# Altium project arm_control_board1.PrjPcb
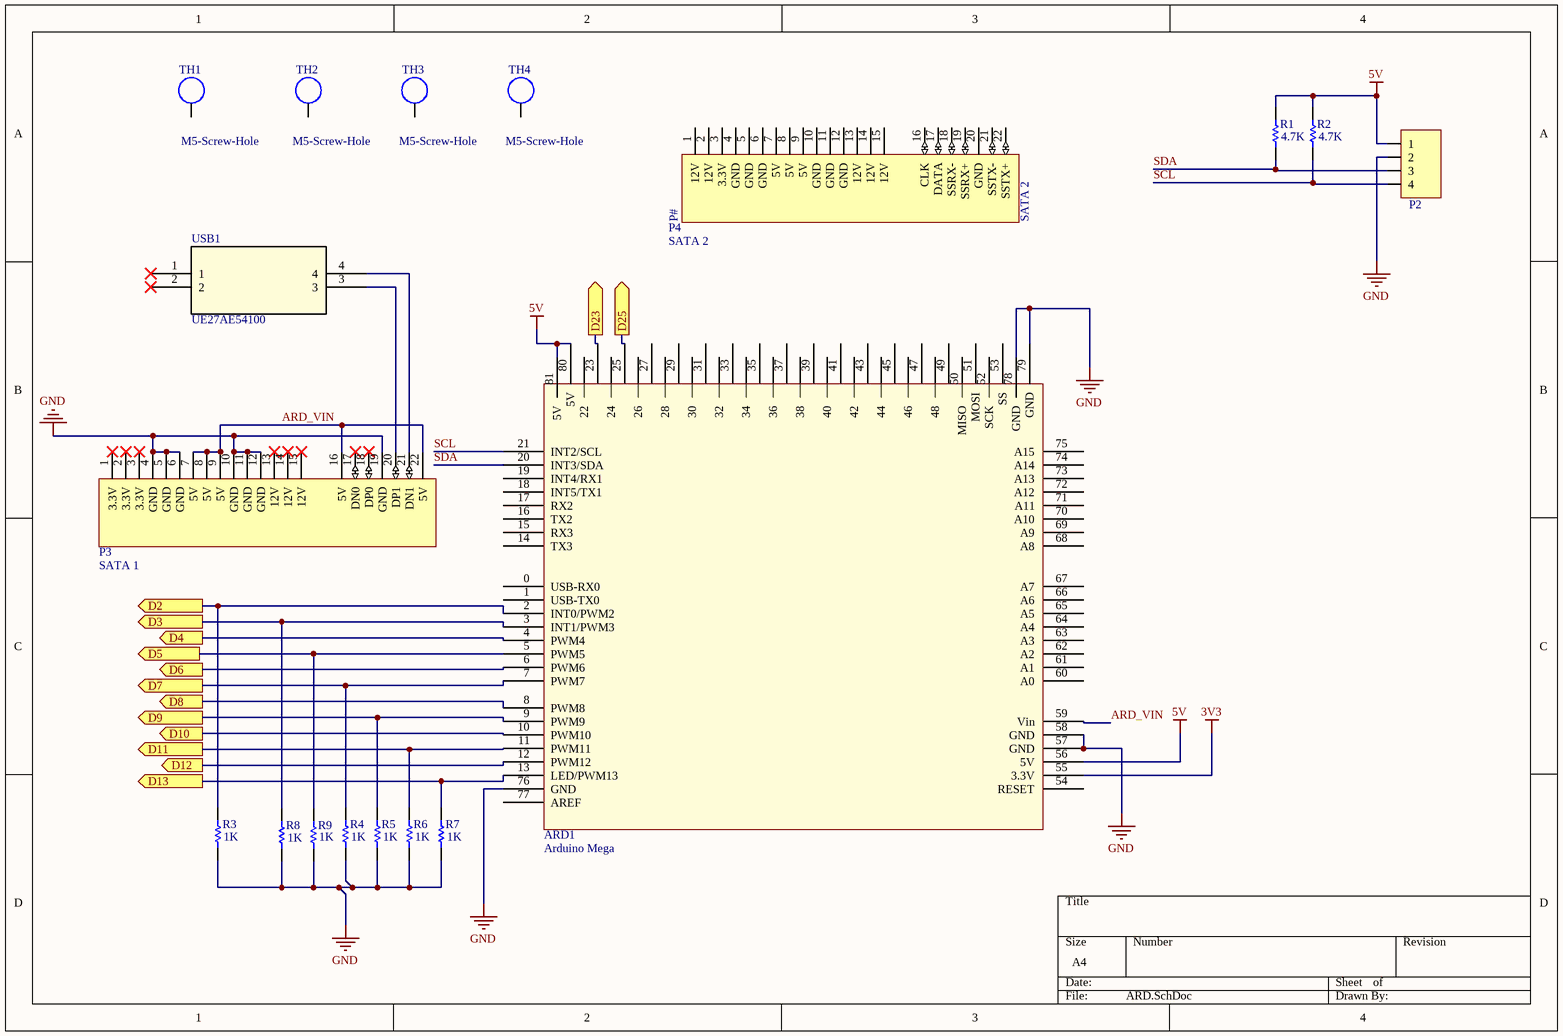
[diagram p0: ARD.SchDoc]
2 sheets, 46 parts. Net scope: flat (ports and power ports of the same name join across sheets).
Board file: Arm_control_pull.PcbDoc
Sheets:
  ARD.SchDoc
  Arm_control_pull.SchDoc

## Sheet ARD.SchDoc
size A4

### Parts
ARD1  Arduino Mega  [Arduino Mega]
P2  Mini-Fit Jr 4 Pos  [MOLEX 0039281043]  (value not drawn)
P3  SATA 1  [Amphenol 10101788-002CLF]
P4  SATA 2  [Amphenol 10101788-002CLF]
R1  value 4.7K  [RESC1608X06N_0603]  (hidden comment: Res1)
R2  value 4.7K  [RESC1608X06N_0603]  (hidden comment: Res1)
R3  value 1K  [RESC1608X06N_0603]  (hidden comment: Res1)
R4  value 1K  [RESC1608X06N_0603]  (hidden comment: Res1)
R5  value 1K  [RESC1608X06N_0603]  (hidden comment: Res1)
R6  value 1K  [RESC1608X06N_0603]  (hidden comment: Res1)
R7  value 1K  [RESC1608X06N_0603]  (hidden comment: Res1)
R8  value 1K  [RESC1608X06N_0603]  (hidden comment: Res1)
R9  value 1K  [RESC1608X06N_0603]  (hidden comment: Res1)
TH1  M5-Screw-Hole  [M5_Screw_Hole]
TH2  M5-Screw-Hole  [M5_Screw_Hole]
TH3  M5-Screw-Hole  [M5_Screw_Hole]
TH4  M5-Screw-Hole  [M5_Screw_Hole]
USB1  UE27AE54100  [UE27AE54100_AMP]

### Ports
D2 (out), D3 (out), D4 (out), D5 (out), D6 (out), D7 (out), D8 (out), D9 (out), D10 (out), D11 (out), D12 (out), D13 (out), D23 (out), D25 (out)

### Nets
3V3: ARD1.55(3.3V)
5V: ARD1.56(5V) ARD1.80(5V) ARD1.81(5V) P2.1 R1.2 R2.2
GND: ARD1.57(GND) ARD1.58(GND) ARD1.76(GND) ARD1.78(GND) ARD1.79(GND) P2.2 P3.4(GND) P3.5(GND) P3.6(GND) P3.10(GND) P3.11(GND) P3.12(GND) P3.19(GND) R3.1 R4.1 R5.1 R6.1 R7.1 R8.1 R9.1
ARD_VIN: ARD1.59(Vin) P3.7(5V) P3.8(5V) P3.9(5V) P3.16(5V) P3.22(5V)
SCL: ARD1.21(INT2/SCL) P2.4 R2.1
SDA: ARD1.20(INT3/SDA) P2.3 R1.1
NetARD1_2: ARD1.2(INT0/PWM2) R3.2 ; port D2
NetARD1_3: ARD1.3(INT1/PWM3) R8.2 ; port D3
NetARD1_4: ARD1.4(PWM4) ; port D4
NetARD1_5: ARD1.5(PWM5) R9.2 ; port D5
NetARD1_6: ARD1.6(PWM6) ; port D6
NetARD1_7: ARD1.7(PWM7) R4.2 ; port D7
NetARD1_8: ARD1.8(PWM8) ; port D8
NetARD1_9: ARD1.9(PWM9) R5.2 ; port D9
NetARD1_10: ARD1.10(PWM10) ; port D10
NetARD1_11: ARD1.11(PWM11) R6.2 ; port D11
NetARD1_12: ARD1.12(PWM12) ; port D12
NetARD1_13: ARD1.13(LED/PWM13) R7.2 ; port D13
NetARD1_23: ARD1.23 ; port D23
NetARD1_25: ARD1.25 ; port D25
NetP3_20: P3.20(DP1) USB1.3
NetP3_21: P3.21(DN1) USB1.4

Not connected (* = marked no-connect by the designer): ARD1 0(USB-RX0) 1(USB-TX0) 14(TX3) 15(RX3) 16(TX2) 17(RX2) 18(INT5/TX1) 19(INT4/RX1) 22 24 26 27 28 29 30 31 32 33 34 35 36 37 38 39 40 41 42 43 44 45 46 47 48 49 50(MISO) 51(MOSI) 52(SCK) 53(SS) 54(RESET) 60(A0) 61(A1) 62(A2) 63(A3) 64(A4) 65(A5) 66(A6) 67(A7) 68(A8) 69(A9) 70(A10) 71(A11) 72(A12) 73(A13) 74(A14) 75(A15) 77(AREF); P3 1(3.3V)* 2(3.3V)* 3(3.3V)* 13(12V)* 14(12V)* 15(12V)* 17(DN0)* 18(DP0)*; P4 1(12V) 2(12V) 3(3.3V) 4(GND) 5(GND) 6(GND) 7(5V) 8(5V) 9(5V) 10(GND) 11(GND) 12(GND) 13(12V) 14(12V) 15(12V) 16(CLK) 17(DATA) 18(SSRX-) 19(SSRX+) 20(GND) 21(SSTX-) 22(SSTX+); TH1 1; TH2 1; TH3 1; TH4 1; USB1 1* 2*

### Notes on the sheet
- (in symbol SATA 2) P#

### Library data of the parts
P2 = Molex 0039281043: Mini-Fit Jr. Header, Dual Row, Right-Angle, with Snap-in Plastic Peg PCB Lock, 6 Circuits, PA Polyamide Nylon 6/6 94V-2, 0.76µm Select Gold (Au) Plating
P3 = SATA 1: SATA connector. / Connector 1 for option 1 as per Spec; Supplier 1: Digi-Key
P4 = SATA 2: SATA connector. / Connector 2 for option 1 as per Spec; Supplier 1: Digi-Key
R1-R9 = Res1: Resistor; Published: 8-Jun-2000; LatestRevisionDate: 17-Jul-2002; LatestRevisionNote: Re-released for DXP Platform.; PackageReference: AXIAL-0.3; Publisher: Altium Limited; PackageDescription: Axial Device, Thru-Hole; 2 Leads; 0.3 in Pin Spacing
USB1 = UE27AE54100: No Description Available; Mfr_Name: Amphenol ICC; Copyright: Copyright (C) 2022 Ultra Librarian. All rights reserved.; Manufacturer_Part_Number: UE27AE54100; Digi-Key_Part_Number_1: UE27AE54100-ND; Digi-Key_Part_Number_2: UE27AE54100-NDL; RefDes: RefDes; Type: DEV

## Sheet Arm_control_pull.SchDoc
size A4
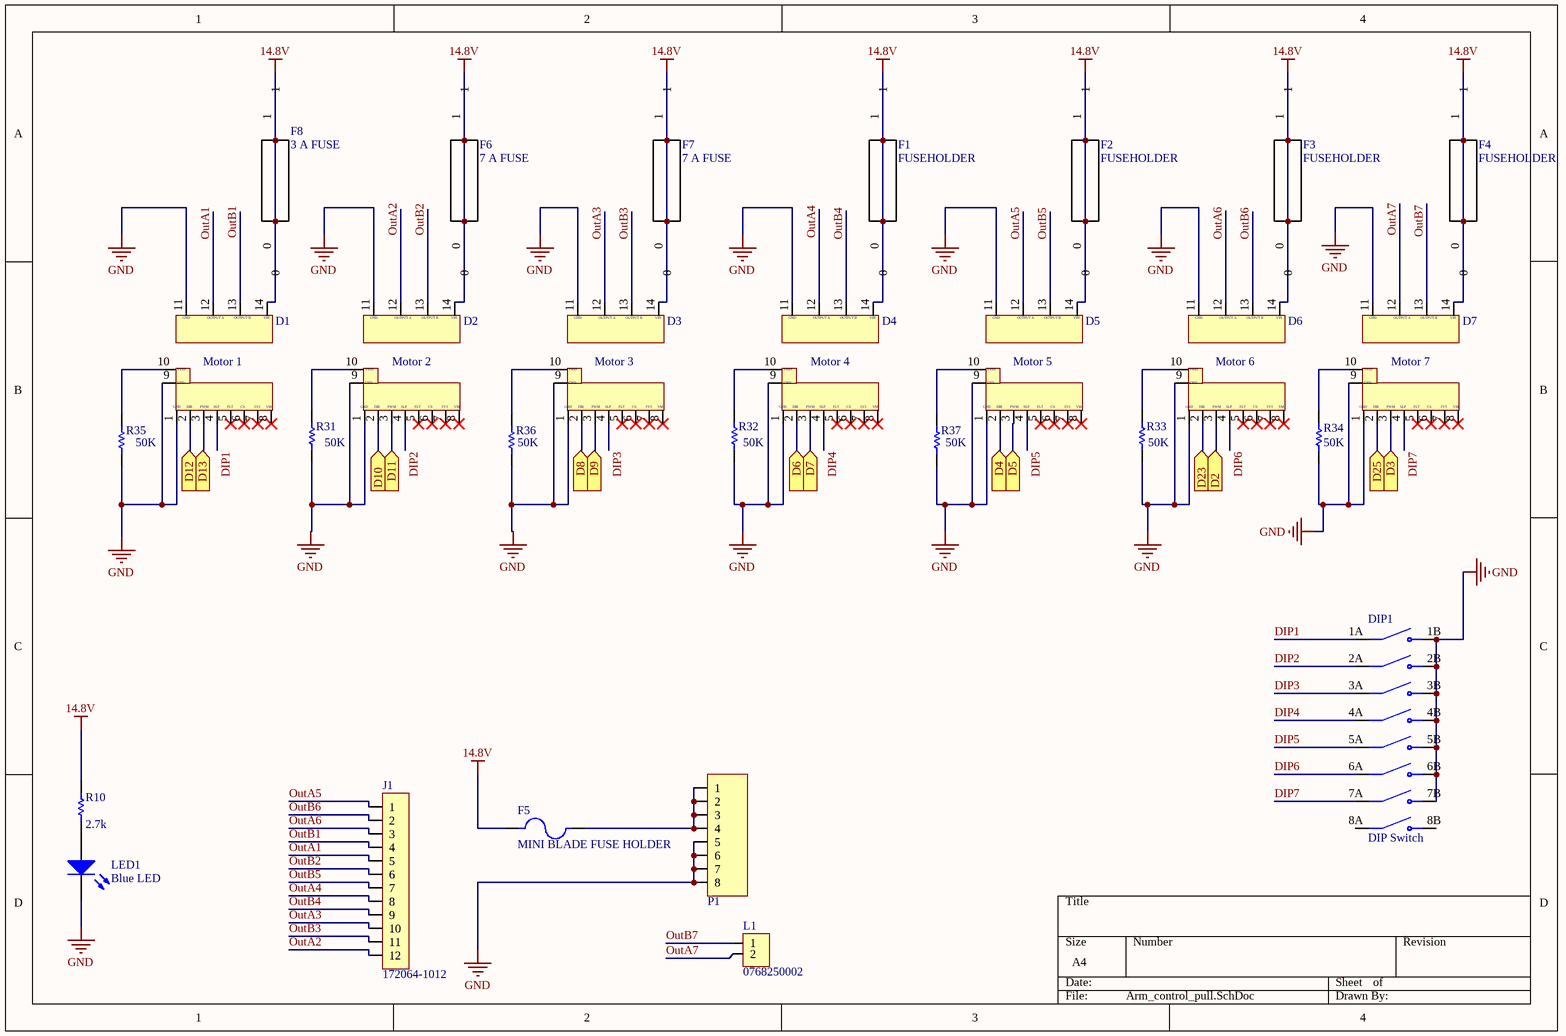
[diagram p1: Arm_control_pull.SchDoc]

### Parts
D1  Pololu G2 High-Power Motor Driver 18v25  [POLOLU 18V25]  (value not drawn)
D2  Pololu G2 High-Power Motor Driver 18v25  [POLOLU 18V25]  (value not drawn)
D3  Pololu G2 High-Power Motor Driver 18v25  [POLOLU 18V25]  (value not drawn)
D4  Pololu G2 High-Power Motor Driver 18v25  [POLOLU 18V25]  (value not drawn)
D5  Pololu G2 High-Power Motor Driver 18v25  [POLOLU 18V25]  (value not drawn)
D6  Pololu G2 High-Power Motor Driver 18v25  [POLOLU 18V25]  (value not drawn)
D7  Pololu G2 High-Power Motor Driver 18v25  [POLOLU 18V25]  (value not drawn)
DIP1  DIP Switch  [DIP Switch]
F1  FUSEHOLDER  [FUSEHOLDER 3557-20]
F2  FUSEHOLDER  [FUSEHOLDER 3557-20]
F3  FUSEHOLDER  [FUSEHOLDER 3557-20]
F4  FUSEHOLDER  [FUSEHOLDER 3557-20]
F5  MINI BLADE FUSE HOLDER  [MINI FUSE HOLDER]
F6  7 A FUSE  [7 A FUSE  0407007.WR]
F7  7 A FUSE  [7 A FUSE  0407007.WR]
F8  3 A FUSE  [3A FUSE ERB-RG3R00V]
J1  172064-1012  [172064-1012]
L1  0768250002  [MOLEX 0768250002]
LED1  Blue LED  [LTST-C171TBKT]
P1  Mini-Fit Jr 8 Pos RA  [MOLEX 172065-0208]  (value not drawn)
R10  value 2.7k  [RESC1608X06N_0603]  (hidden comment: Res1)
R31  value 50K  [RESC1608X06N_0603]  (hidden comment: Res1)
R32  value 50K  [RESC1608X06N_0603]  (hidden comment: Res1)
R33  value 50K  [RESC1608X06N_0603]  (hidden comment: Res1)
R34  value 50K  [RESC1608X06N_0603]  (hidden comment: Res1)
R35  value 50K  [RESC1608X06N_0603]  (hidden comment: Res1)
R36  value 50K  [RESC1608X06N_0603]  (hidden comment: Res1)
R37  value 50K  [RESC1608X06N_0603]  (hidden comment: Res1)

### Ports
D2 (in), D3 (in), D4 (in), D5 (in), D6 (in), D7 (in), D8 (in), D9 (in), D10 (in), D11 (in), D12 (in), D13 (in), D23 (in), D25 (in)

### Nets
14.8V: D1.14 D2.14 D3.14 D4.14 D5.14 D6.14 D7.14 F1.0 F1.1 F2.0 F2.1 F3.0 F3.1 F4.0 F4.1 F5.2 F6.0 F6.1 F7.0 F7.1 F8.0 F8.1 R10.1
GND: D1.1 D1.9 D1.11 D2.1 D2.9 D2.11 D3.1 D3.9 D3.11 D4.1 D4.9 D4.11 D5.1 D5.9 D5.11 D6.1 D6.9 D6.11 D7.1 D7.9 D7.11 DIP1.1B(NO1) DIP1.2B(NO2) DIP1.3B(NO3) DIP1.4B(NO4) DIP1.5B(NO5) DIP1.6B(NO6) DIP1.7B(NO7) LED1.2(K) P1.5 P1.6 P1.7 P1.8 R31.1 R32.1 R33.1 R34.1 R35.1 R36.1 R37.1
DIP1: D1.4 DIP1.1A(COM1)
DIP2: D2.4 DIP1.2A(COM2)
DIP3: D3.4 DIP1.3A(COM3)
DIP4: D4.4 DIP1.4A(COM4)
DIP5: D5.4 DIP1.5A(COM5)
DIP6: D6.4 DIP1.6A(COM6)
DIP7: D7.4 DIP1.7A(COM7)
OutA1: D1.12 J1.5
OutA2: D2.12 J1.12
OutA3: D3.12 J1.10
OutA4: D4.12 J1.8
OutA5: D5.12 J1.1
OutA6: D6.12 J1.3
OutA7: D7.12 L1.2
OutB1: D1.13 J1.4
OutB2: D2.13 J1.6
OutB3: D3.13 J1.11
OutB4: D4.13 J1.9
OutB5: D5.13 J1.7
OutB6: D6.13 J1.2
OutB7: D7.13 L1.1
NetARD1_2: D6.3 ; port D2
NetARD1_3: D7.3 ; port D3
NetARD1_4: D5.2 ; port D4
NetARD1_5: D5.3 ; port D5
NetARD1_6: D4.2 ; port D6
NetARD1_7: D4.3 ; port D7
NetARD1_8: D3.2 ; port D8
NetARD1_9: D3.3 ; port D9
NetARD1_10: D2.2 ; port D10
NetARD1_11: D2.3 ; port D11
NetARD1_12: D1.2 ; port D12
NetARD1_13: D1.3 ; port D13
NetARD1_23: D6.2 ; port D23
NetARD1_25: D7.2 ; port D25
NetD1_10: D1.10 R35.2
NetD2_10: D2.10 R31.2
NetD3_10: D3.10 R36.2
NetD4_10: D4.10 R32.2
NetD5_10: D5.10 R37.2
NetD6_10: D6.10 R33.2
NetD7_10: D7.10 R34.2
NetF5_1: F5.1 P1.1 P1.2 P1.3 P1.4
NetLED1_1: LED1.1(A) R10.2

Not connected (* = marked no-connect by the designer): D1 5* 6* 7* 8*; D2 5* 6* 7* 8*; D3 5* 6* 7* 8*; D4 5* 6* 7* 8*; D5 5* 6* 7* 8*; D6 5* 6* 7* 8*; D7 5* 6* 7* 8*; DIP1 8A(COM8) 8B(NO8)

### Notes on the sheet
- (near D1) Motor 1
- (near D2) Motor 2
- (near D3) Motor 3
- (near D4) Motor 4
- (near D5) Motor 5
- (near D6) Motor 6
- (near D7) Motor 7
- (in symbol Pololu G2 High-Power Motor Driver 18v25) GND; OUTPUT A; OUTPUT B; VIN; VREF; DIR; PWM; SLP; FLT; CS; 3V3; VM

### Library data of the parts
F5 = 01530007Z: Fuse Holder 15A 32V 1 Circuit Blade Through Hole; Package: None; Price: None; Value: *; MP: 01530007Z; Availability: Unavailable
J1 = 172064-1012: Conn Shrouded Header HDR 12 POS 5.7mm Solder RA Thru-Hole Tray; Manufacturer 1: Molex Waldom; Number of Positions: 12; Connector Type: Male Pin; Row Spacing: 0.224inch; Glow Wire Compliant: Compliant; Supplier 1: Digi-Key; Supplier Part Number 1: WM11214-ND; Manufacturer Part Number 1: 172064-1012; Stock 1: 343; Pricing 1: 1=16.34000, 10=14.85400, 100=12.62590, 500=10.76916, 1000=9.87791 (USD); RoHS: Yes; Mount: Through Hole; Contact Plating: Gold; Color: Black; Min Operating Temperature: -40°C; Max Operating Temperature: 120°C; Packaging: Tray; Number of Rows: 2; Termination: Solder; Fastening Type: Ramp; Number of Contacts: 12; Orientation: Right Angle; Number of Circuits: 12; Pitch: 5.7mm; Halogen Free: Low Halogen; ComponentLink1URL: http://www.molex.com/pdm_docs/ps/PS-76823-100.pdf?src-supplier=Digi-Key; ComponentLink1Description: http://www.molex.com/pdm_docs/ps/PS-76823-100.pdf?src-supplier=Digi-Key; ComponentLink2URL: http://www.molex.com/pdm_docs/sd/1720641004_sd.pdf?src-supplier=Avnet; ComponentLink2Description: http://www.molex.com/pdm_docs/sd/1720641004_sd.pdf?src-supplier=Avnet; Category: Connectors
L1 = 0768250002: Conn Power HDR 2 POS 5.7mm Solder RA Thru-Hole 2 Terminal 1 Port; Manufacturer 1: Molex; Color: Black; Number of Positions: 2; Connector Type: Male Pin; Row Spacing: 0.224inch; Supplier 1: Digi-Key; Supplier Part Number 1: WM11969-ND; Manufacturer Part Number 1: 0768250002; Stock 1: 2157; Pricing 1: 1=1.13000, 10=0.99300, 25=0.93440, 50=0.89560, 100=0.85670, 250=0.77880, 500=0.70092, 2016=0.58410, 4032=0.56463 (USD); RoHS: Yes; Mount: Through Hole; Contact Plating: Tin; Number of Rows: 2; Termination: Solder; Packaging: Tray; Fastening Type: Ramp; ComponentLink1URL: https://www.molex.com/pdm_docs/sd/768250002_sd.pdf?src-supplier=Digi-Key; ComponentLink1Description: https://www.molex.com/pdm_docs/sd/768250002_sd.pdf?src-supplier=Digi-Key; Category: Connectors
P1 = Molex Mega-Fit 8pos Vert
R10 R31-R37 = Res1: Resistor; Published: 8-Jun-2000; LatestRevisionDate: 17-Jul-2002; LatestRevisionNote: Re-released for DXP Platform.; PackageReference: AXIAL-0.3; Publisher: Altium Limited; PackageDescription: Axial Device, Thru-Hole; 2 Leads; 0.3 in Pin Spacing
D1-D7 = Pololu G2 High-Power Motor Driver 18v25: Category: Brushed DC motor

## Nets that join several sheets
GND: ARD (20 pins), Arm_control_pull (40 pins)
NetARD1_2: ARD (ARD1.2 R3.2), Arm_control_pull (D6.3)
NetARD1_3: ARD (ARD1.3 R8.2), Arm_control_pull (D7.3)
NetARD1_4: ARD (ARD1.4), Arm_control_pull (D5.2)
NetARD1_5: ARD (ARD1.5 R9.2), Arm_control_pull (D5.3)
NetARD1_6: ARD (ARD1.6), Arm_control_pull (D4.2)
NetARD1_7: ARD (ARD1.7 R4.2), Arm_control_pull (D4.3)
NetARD1_8: ARD (ARD1.8), Arm_control_pull (D3.2)
NetARD1_9: ARD (ARD1.9 R5.2), Arm_control_pull (D3.3)
NetARD1_10: ARD (ARD1.10), Arm_control_pull (D2.2)
NetARD1_11: ARD (ARD1.11 R6.2), Arm_control_pull (D2.3)
NetARD1_12: ARD (ARD1.12), Arm_control_pull (D1.2)
NetARD1_13: ARD (ARD1.13 R7.2), Arm_control_pull (D1.3)
NetARD1_23: ARD (ARD1.23), Arm_control_pull (D6.2)
NetARD1_25: ARD (ARD1.25), Arm_control_pull (D7.2)